# Altium schematic sheet [05]-POWER.SchDoc
size A
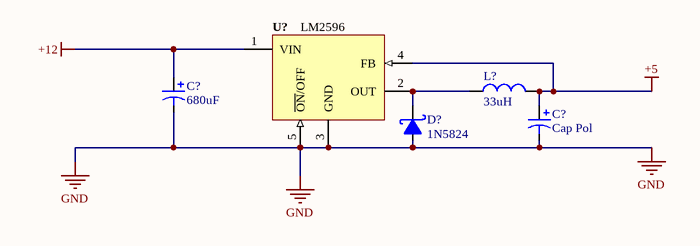
[diagram p0: [05]-POWER.SchDoc]

## Parts
(Parts that share a designator on the sheet are numbered #1, #2 ... from top to bottom, then left to right.)
C?#1  680uF  [C3MM]
C?#2  Cap Pol  [C3MM]
D?  1N5824  [D5A]
L?  33uH  [L/0.4]
U?  LM2596  [TO263]

## Nets
+5: C?#2.1 L?.2 U?.4(FB)
+12: C?#1.1 U?.1(VIN)
GND: C?#1.2 C?#2.2 D?.1(A) U?.3(GND) U?.5(~{ON}/OFF)
NetD?_2: D?.2(K) L?.1 U?.2(OUT)

## Library data of the parts
C?#1 C?#2 = Cap Pol: Polarized Capacitor (Axial); Published: 8-Jun-2000; LatestRevisionDate: 17-Jul-2002; LatestRevisionNote: Re-released for DXP Platform.; PackageReference: POLAR0.8; Publisher: Altium Limited
D? = 1N5822: Schottky Rectifiers; Value: Diode c?m 1N5408
L? = Inductor: Value: 150 mH
U? = LM2596: Max Input Voltage: 12 V; Max Output Current: 3 (6.0 peak) A; Max Output Voltage: mV; Category: IC-Power; Min Input Voltage: mV; Min Output Voltage: mV; Mounting Technology: Surface Mount; Status: Unreleased; Supply Voltage: mV; Temperature Range: -40 to +125 degC